# EAGLE design triple8_4 (EAGLE 5.06)
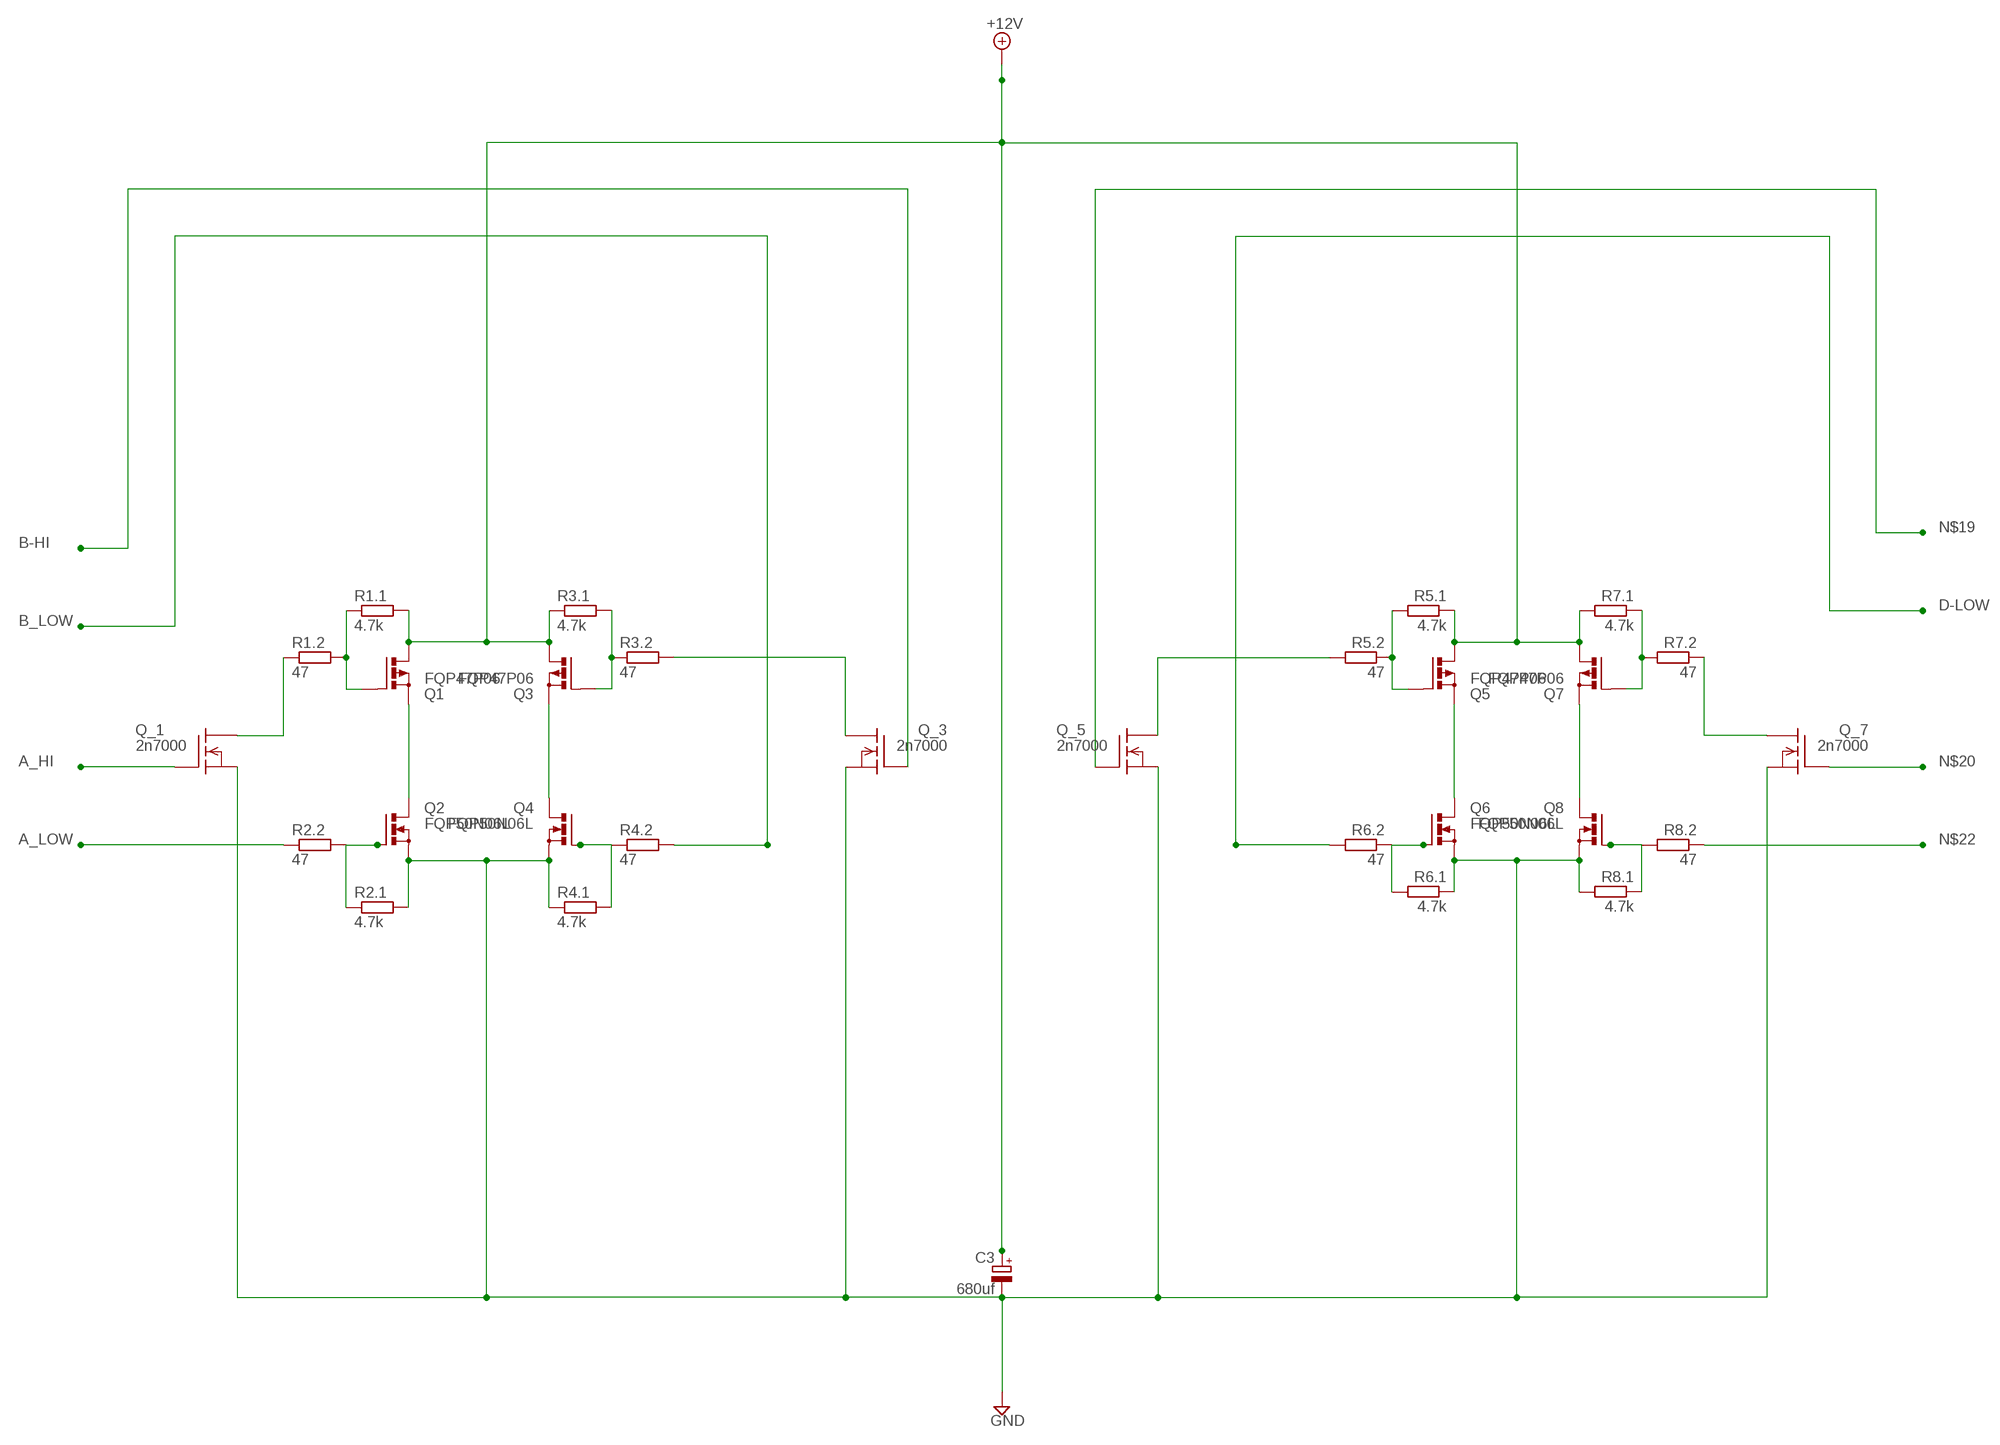
[diagram p0: schematic, sheet 1]

## Parts
C3  680uf  CPOL-EUE5-13  [E5-13]
Q1  FQP47P06  PMOSFET_PTO220BV  [TO220BV]
Q2  FQP50N06L  PMOSFET_NTO220BV  [TO220BV]
Q3  FQP47P06  PMOSFET_PTO220BV  [TO220BV]
Q4  FQP50N06L  PMOSFET_NTO220BV  [TO220BV]
Q5  FQP47P06  PMOSFET_PTO220BV  [TO220BV]
Q6  FQP50N06L  PMOSFET_NTO220BV  [TO220BV]
Q7  FQP47P06  PMOSFET_PTO220BV  [TO220BV]
Q8  FQP50N06L  PMOSFET_NTO220BV  [TO220BV]
Q_1  2n7000  BSS101  [TO92]
Q_3  2n7000  BSS101  [TO92]
Q_5  2n7000  BSS101  [TO92]
Q_7  2n7000  BSS101  [TO92]
R1.1  4.7k  R-EU_0204/5  [0204/5]
R1.2  47  R-EU_0204/5  [0204/5]
R2.1  4.7k  R-EU_0204/5  [0204/5]
R2.2  47  R-EU_0204/5  [0204/5]
R3.1  4.7k  R-EU_0204/5  [0204/5]
R3.2  47  R-EU_0204/5  [0204/5]
R4.1  4.7k  R-EU_0204/5  [0204/5]
R4.2  47  R-EU_0204/5  [0204/5]
R5.1  4.7k  R-EU_0204/5  [0204/5]
R5.2  47  R-EU_0204/5  [0204/5]
R6.1  4.7k  R-EU_0204/5  [0204/5]
R6.2  47  R-EU_0204/5  [0204/5]
R7.1  4.7k  R-EU_0204/5  [0204/5]
R7.2  47  R-EU_0204/5  [0204/5]
R8.1  4.7k  R-EU_0204/5  [0204/5]
R8.2  47  R-EU_0204/5  [0204/5]

## Nets
+12V: C3.+ Q1.S(D) Q3.S(D) Q5.S(D) Q7.S(D) R1.1.2 R3.1.1 R5.1.1 R7.1.2
A_HI: Q_1.2(G)
A_LOW: R2.2.1
B-HI: Q_3.2(G)
B_LOW: R4.2.2
D-LOW: R6.2.2
GND: C3.- Q2.S Q4.S Q6.S Q8.S Q_1.1(S) Q_3.1(S) Q_5.1(S) Q_7.1(S) R2.1.2 R4.1.1 R6.1.1 R8.1.2
N$2: Q5.G R5.1.2 R5.2.1
N$3: Q2.G R2.1.1 R2.2.2
N$4: Q4.G R4.1.2 R4.2.1
N$5: Q7.G R7.1.1 R7.2.2
N$7: Q8.G R8.1.1 R8.2.2
N$8: Q_1.3(D) R1.2.1
N$9: Q6.G R6.1.2 R6.2.1
N$10: Q1.G R1.1.1 R1.2.2
N$11: Q3.G R3.1.2 R3.2.1
N$12: Q5.D(S) Q6.D
N$14: Q_7.3(D) R7.2.1
N$17: Q_5.3(D) R5.2.2
N$18: Q1.D(S) Q2.D
N$19: Q_5.2(G)
N$20: Q_7.2(G)
N$22: R8.2.1
N$29: Q_3.3(D) R3.2.2
N$35: Q3.D(S) Q4.D
N$37: Q7.D(S) Q8.D

## Library data of the parts
C3 = resistor:CPOL-EU: POLARIZED CAPACITOR, European symbol
Q1 Q3 Q5 Q7 = transistor-power2:PMOSFET_P: Power MOSFET P-Channel
Q2 Q4 Q6 Q8 = transistor-power:PMOSFET_N: Power MOSFET N-Channel
Q_1 Q_3 Q_5 Q_7 = transistor-fet:BSS101: N-Channel Enhancement MOSFET 200V; 0,16A; 11Ohm
R1.1 R1.2 R2.1 R2.2 R3.1 R3.2 R4.1 R4.2 R5.1 R5.2 R6.1 R6.2 R7.1 R7.2 R8.1 R8.2 = rcl:R-EU_: RESISTOR, European symbol

## Board
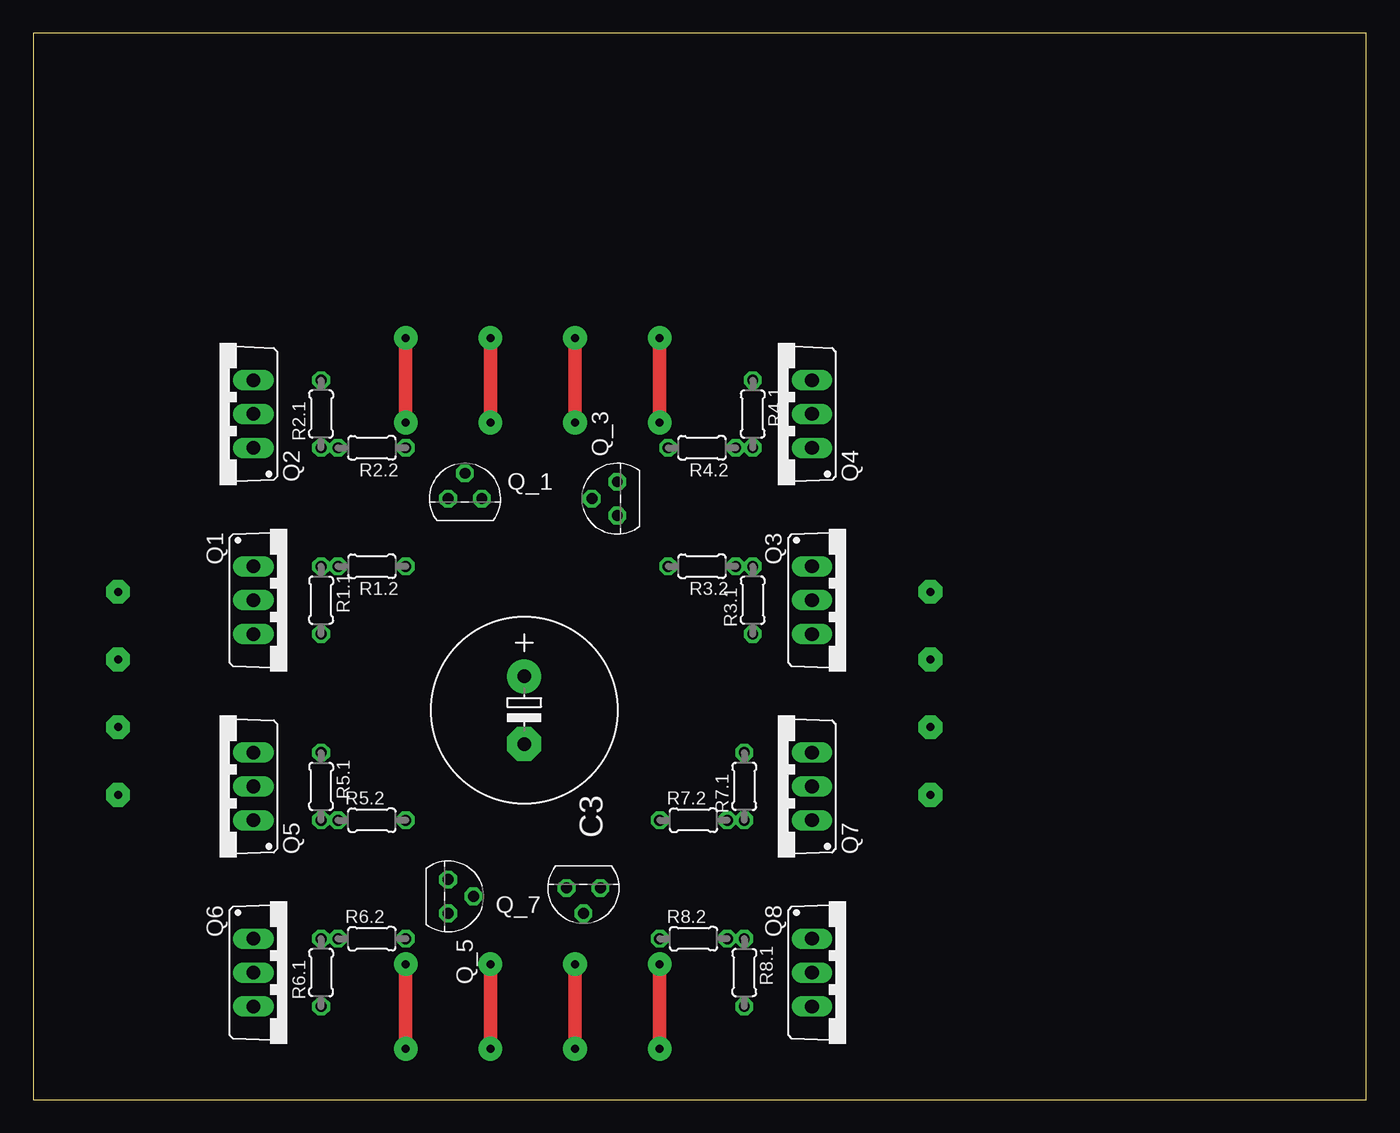
[diagram p1: board, top side]
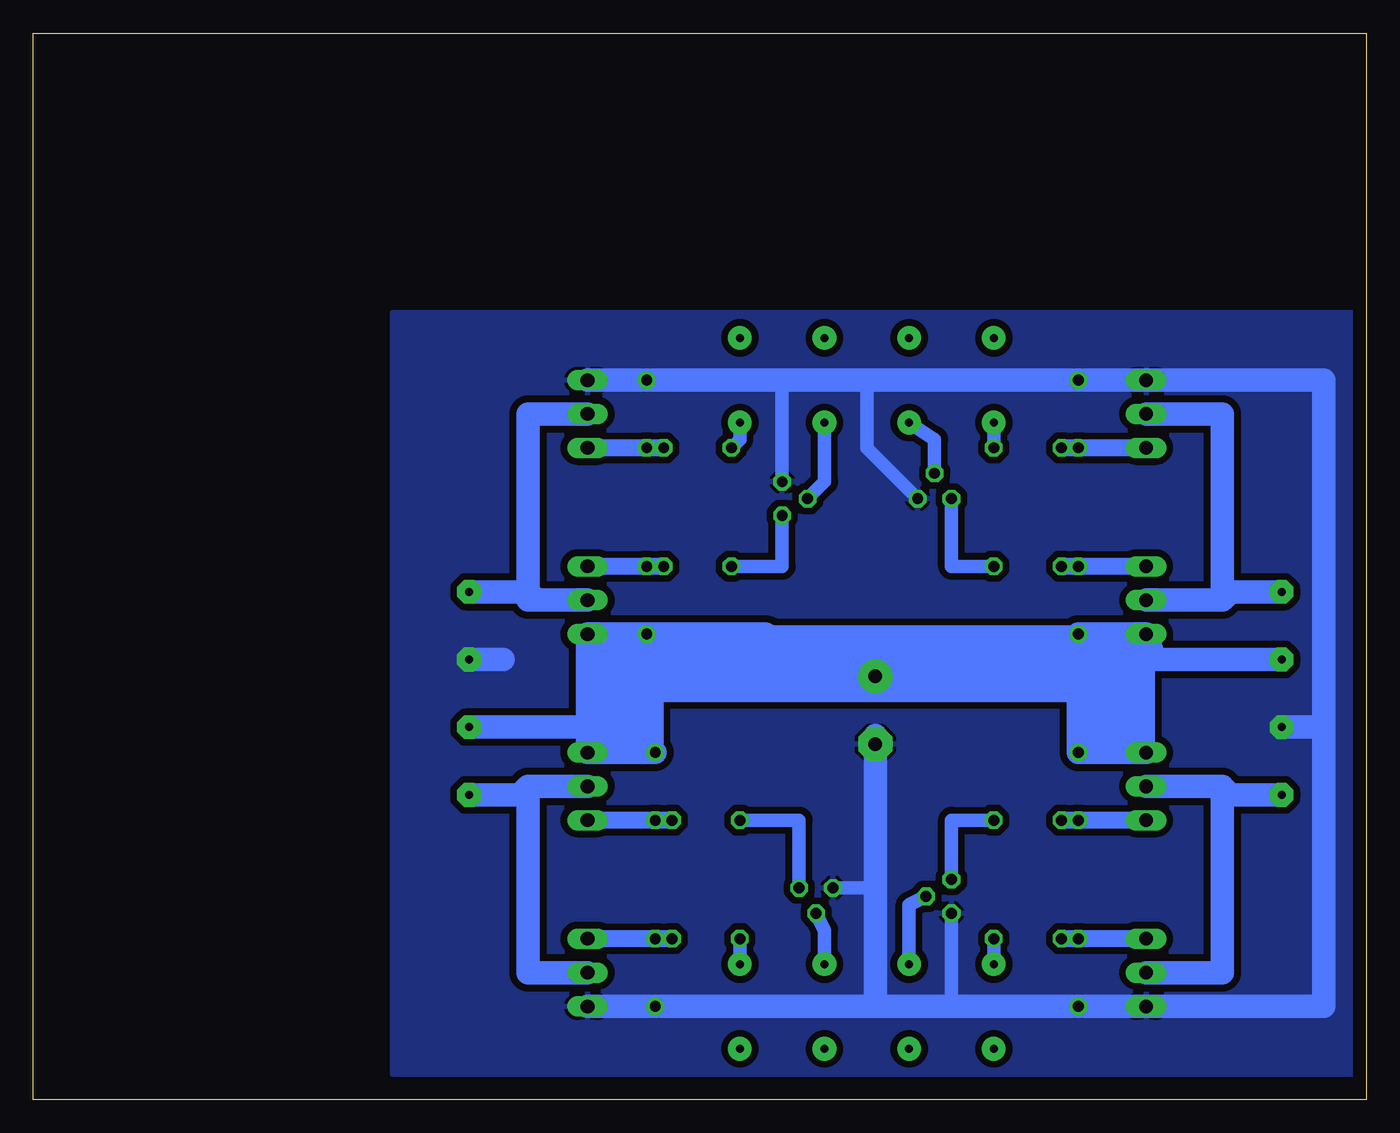
[diagram p2: board, bottom side, seen from below]

Size 100 x 80 mm. Coordinates in mm from the lower left corner, seen from the top.
Outline: 0,0 100,0 100,80 0,80 0,0
Copper layers (1*16): Top 0.035mm / dielectric 1.5mm / Bottom 0.035mm
Design rules "default *": minimum track width 10mil, minimum drill 24mil, track to track 20mil, track to pad 20mil, pad to pad 8mil, via to via 8mil, smd to smd 8mil, copper to edge 40mil, drill to drill 8mil, minimum pad ring 10mil, minimum via ring 8mil, stop-mask expansion 4mil, vias tented up to drill 0mil, thermal gap 10mil

### Footprints (pad centres in the part's own frame; a part is rotated, then mirrored left to right if it is on the bottom)
E5-13 = drill 1.016 pad 2.54 round: + -2.54,0 | drill 1.016 pad 2.54 octagon: - 2.54,0
TO220BV = drill 1.016 long: D 0,-2.54; G -2.54,-2.54; S 2.54,-2.54
TO92 = drill 0.813 octagon: 1 1.27,0; 2 0,1.905; 3 -1.27,0
0204/5 = drill 0.813 octagon: 1 -2.54,0; 2 2.54,0

### Placement (x,y rotation side)
C3  36.83,29.21 270 top
Q1  19.05,37.47 270 top
Q2  13.97,51.44 90 top
Q3  60.96,37.47 270 top
Q4  55.88,51.44 90 top
Q5  13.97,23.5 90 top
Q6  19.05,9.53 270 top
Q7  55.88,23.5 90 top
Q8  60.96,9.53 270 top
Q_1  32.38,45.09 0 top
Q_3  43.81,45.09 90 top
Q_5  31.11,15.24 270 top
Q_7  41.27,15.88 180 top
R1.1  21.59,37.47 270 top
R1.2  25.4,40.01 180 top
R2.1  21.59,51.44 90 top
R2.2  25.4,48.9 180 top
R3.1  53.98,37.47 90 top
R3.2  50.16,40.01 180 top
R4.1  53.98,51.44 270 top
R4.2  50.16,48.9 180 top
R5.1  21.59,23.5 270 top
R5.2  25.4,20.95 0 top
R6.1  21.59,9.53 90 top
R6.2  25.4,12.06 0 top
R7.1  53.34,23.5 90 top
R7.2  49.53,20.95 0 top
R8.1  53.34,9.53 270 top
R8.2  49.53,12.06 0 top

### Tracks (layer width: path | path; a pad name or v marks a point on that pad's centre or on a via)
+12V  (via drill 0.6 pad 1.78)
  Bottom 1.778: R7.1.2 Q7.S 58.42,27.94 | 58.42,27.94 Q3.S R3.1.1 45.09,34.92 C3.+ 21.59,31.75 | Q5.S R5.1.1 21.59,31.75 | 21.59,31.75 R1.1.2 Q1.S 15.88,33.02 v6.35,33.02 | 58.42,27.94 v67.31,27.94
A_HI  (via drill 0.6 pad 1.78)
  Top 1.016: v34.29,50.8 v34.29,57.15
  Bottom 1.016: Q_1.2 32.38,49.53 v34.29,50.8
A_LOW  (via drill 0.6 pad 1.78)
  Top 1.016: v27.94,50.8 v27.94,57.15
  Bottom 1.016: R2.2.1 v27.94,50.8
B-HI  (via drill 0.6 pad 1.78)
  Top 1.016: v40.64,50.8 v40.64,57.15
  Bottom 1.016: v40.64,50.8 40.64,46.35 Q_3.2
B_LOW  (via drill 0.6 pad 1.78)
  Top 1.016: v46.99,50.8 v46.99,57.15
  Bottom 1.016: v46.99,50.8 46.99,49.53 R4.2.2
D-LOW  (via drill 0.6 pad 1.78)
  Top 1.016: v27.94,3.81 v27.94,10.16
  Bottom 1.016: v27.94,10.16 R6.2.2
GND  (via drill 0.6 pad 1.78)
  Bottom 0.254: Q2.S R2.1.2 27.94,53.98
  Bottom 1.016: 43.81,53.98 Q_3.1 | 37.47,53.98 37.47,48.9 Q_1.1 | 31.11,6.99 Q_5.1 | 36.83,6.99 36.83,15.88 Q_7.1
  Bottom 1.778: Q4.S R4.1.1 43.81,53.98 37.47,53.98 27.94,53.98 3.17,53.98 3.17,27.94 | R8.1.2 Q8.S 36.83,6.99 | 36.83,6.99 31.11,6.99 R6.1.1 Q6.S 3.17,6.99 3.17,27.94 | 36.83,6.99 C3.- 36.83,27.3 | 3.17,27.94 v6.35,27.94 | 64.77,33.02 v67.31,33.02
  pour Bottom: 0.64,59.05 73.03,59.05 73.03,1.91 0.64,1.91
N$2
  Bottom 1.27: R5.2.1 R5.1.2 Q5.G
N$3
  Bottom 1.27: R2.2.2 R2.1.1 Q2.G
N$4
  Bottom 1.27: R4.2.1 R4.1.2 Q4.G
N$5
  Bottom 0.254: R7.1.1 Q7.G
  Bottom 1.27: R7.2.2 R7.1.1 Q7.G
N$7
  Bottom 0.254: R8.1.1 Q8.G
  Bottom 1.27: R8.2.2 R8.1.1 Q8.G
N$8
  Bottom 1.016: R1.2.1 31.11,40.01 Q_1.3
N$9
  Bottom 1.27: R6.2.1 R6.1.2 Q6.G
N$10
  Bottom 1.27: R1.2.2 R1.1.1 Q1.G
N$11
  Bottom 1.27: Q3.G R3.1.2 R3.2.1
N$12  (via drill 0.6 pad 1.78)
  Bottom 1.778: Q6.D 10.79,9.53 10.79,23.5 | 10.79,23.5 Q5.D | v6.35,22.86 10.16,22.86 10.79,23.5
N$14
  Bottom 1.016: Q_7.3 42.55,20.95 R7.2.1
N$17
  Bottom 1.016: R5.2.2 31.11,20.95 Q_5.3
N$18  (via drill 0.6 pad 1.78)
  Bottom 1.778: 10.79,37.47 Q1.D | 10.79,37.47 10.79,51.44 Q2.D | v6.35,38.1 10.16,38.1 10.79,37.47
N$19  (via drill 0.6 pad 1.78)
  Top 1.016: v34.29,3.81 v34.29,10.16
  Bottom 1.016: v34.29,10.16 34.29,14.61 Q_5.2
N$20  (via drill 0.6 pad 1.78)
  Top 1.016: 40.64,4.45 v40.64,3.81 v40.64,10.16
  Bottom 1.016: v40.64,10.16 40.64,12.7 Q_7.2
N$22  (via drill 0.6 pad 1.78)
  Top 1.016: v46.99,3.81 v46.99,10.16
  Bottom 1.016: v46.99,10.16 R8.2.1
N$29
  Bottom 1.016: R3.2.2 43.81,40.01 Q_3.3
N$35  (via drill 0.6 pad 1.78)
  Bottom 1.778: Q3.D 62.23,37.47 | Q4.D 62.87,51.44 62.87,37.47 62.23,37.47 | v67.31,38.1 62.87,38.1 62.23,37.47
N$37  (via drill 0.6 pad 1.78)
  Bottom 1.778: Q8.D 62.87,9.53 62.87,23.5 | 62.87,23.5 Q7.D | v67.31,22.86 63.5,22.86 62.87,23.5
(copper drawn outside any net)
  shapes: Bottom area x3